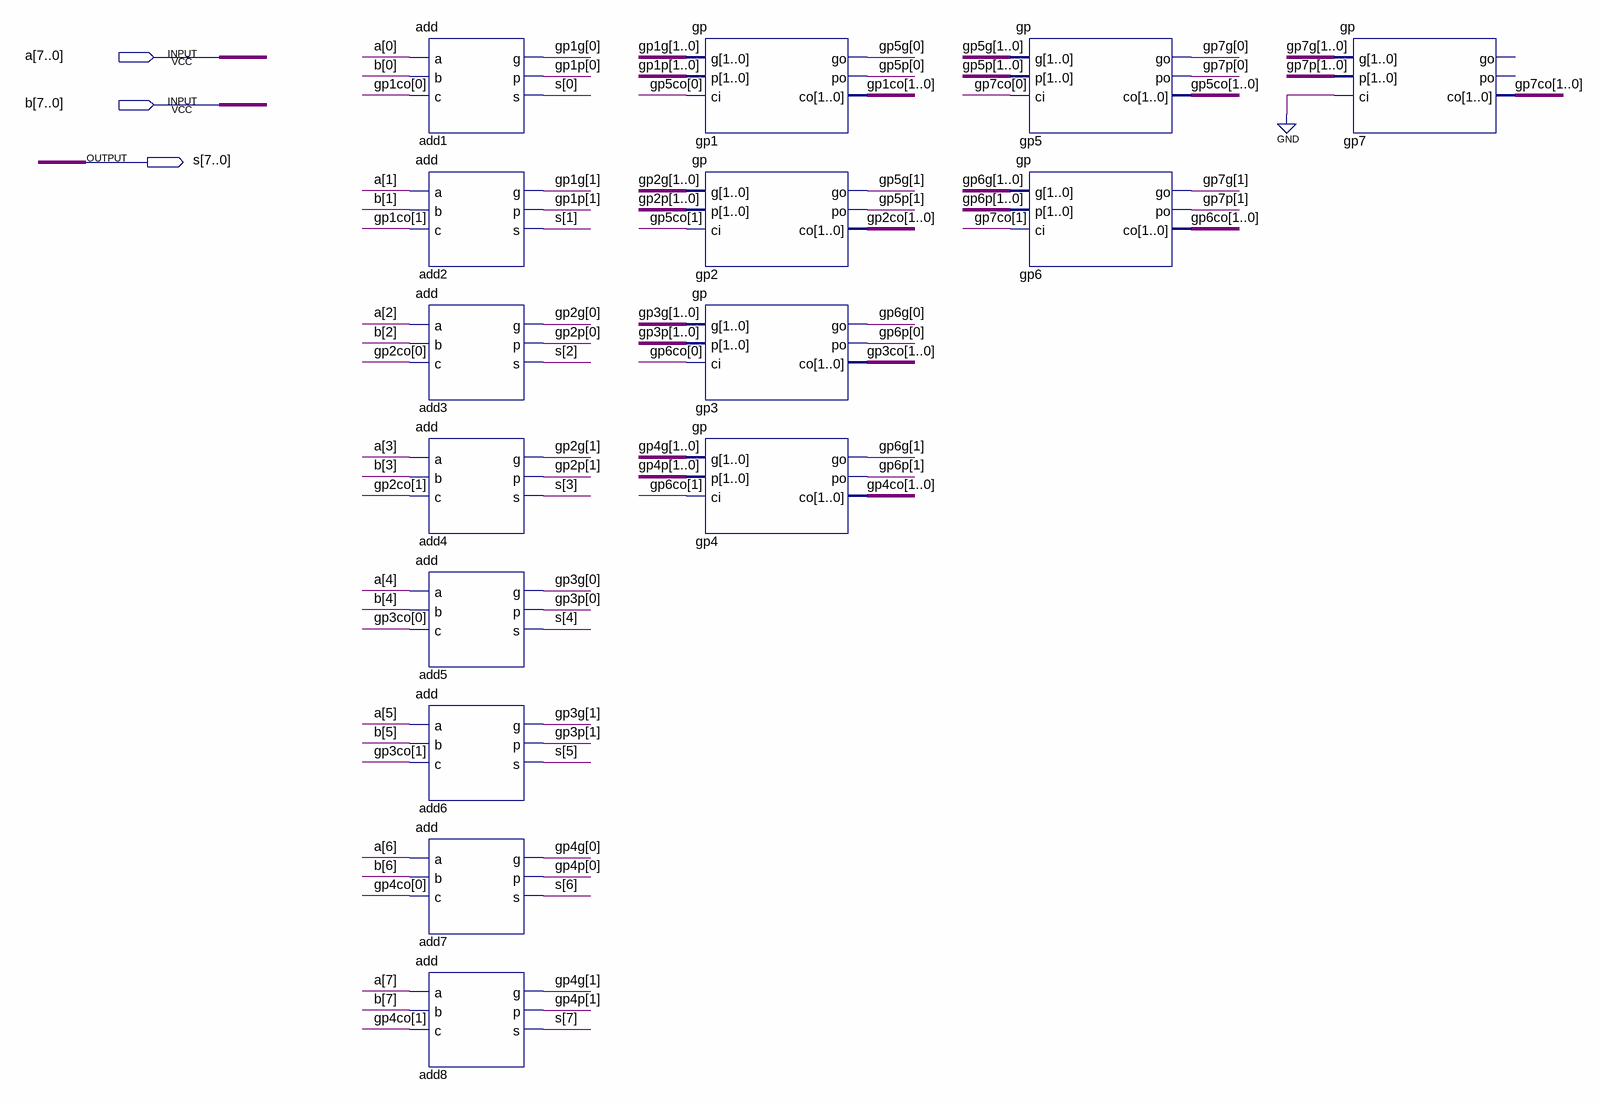
[diagram p0: schematic sheet]
// Quartus schematic carry_lookahead_tree_adder.bdf as structural Verilog: 15 symbols, 3 pins
module carry_lookahead_tree_adder (
  input  [7:0] a,
  input  [7:0] b,
  output [7:0] s
);

  wire [1:0] gp1co, gp1g, gp1p, gp2co, gp2g, gp2p, gp3co, gp3g, gp3p, gp4co, gp4g, gp4p, gp5co, gp5g, gp5p,
       gp6co, gp6g, gp6p, gp7co, gp7g, gp7p;

  add add1 (.a(a[0]), .b(b[0]), .c(gp1co[0]), .g(gp1g[0]), .p(gp1p[0]), .s(s[0]));
  add add2 (.a(a[1]), .b(b[1]), .c(gp1co[1]), .g(gp1g[1]), .p(gp1p[1]), .s(s[1]));
  add add3 (.a(a[2]), .b(b[2]), .c(gp2co[0]), .g(gp2g[0]), .p(gp2p[0]), .s(s[2]));
  add add4 (.a(a[3]), .b(b[3]), .c(gp2co[1]), .g(gp2g[1]), .p(gp2p[1]), .s(s[3]));
  add add5 (.a(a[4]), .b(b[4]), .c(gp3co[0]), .g(gp3g[0]), .p(gp3p[0]), .s(s[4]));
  add add6 (.a(a[5]), .b(b[5]), .c(gp3co[1]), .g(gp3g[1]), .p(gp3p[1]), .s(s[5]));
  add add7 (.a(a[6]), .b(b[6]), .c(gp4co[0]), .g(gp4g[0]), .p(gp4p[0]), .s(s[6]));
  add add8 (.a(a[7]), .b(b[7]), .c(gp4co[1]), .g(gp4g[1]), .p(gp4p[1]), .s(s[7]));
  gp gp1 (.g(gp1g), .p(gp1p), .ci(gp5co[0]), .go(gp5g[0]), .po(gp5p[0]), .co(gp1co));
  gp gp2 (.g(gp2g), .p(gp2p), .ci(gp5co[1]), .go(gp5g[1]), .po(gp5p[1]), .co(gp2co));
  gp gp3 (.g(gp3g), .p(gp3p), .ci(gp6co[0]), .go(gp6g[0]), .po(gp6p[0]), .co(gp3co));
  gp gp4 (.g(gp4g), .p(gp4p), .ci(gp6co[1]), .go(gp6g[1]), .po(gp6p[1]), .co(gp4co));
  gp gp5 (.g(gp5g), .p(gp5p), .ci(gp7co[0]), .go(gp7g[0]), .po(gp7p[0]), .co(gp5co));
  gp gp6 (.g(gp6g), .p(gp6p), .ci(gp7co[1]), .go(gp7g[1]), .po(gp7p[1]), .co(gp6co));
  gp gp7 (.g(gp7g), .p(gp7p), .ci(1'b0), .co(gp7co));  // open: go, po
endmodule
